# Altium project phone.PrjPcb
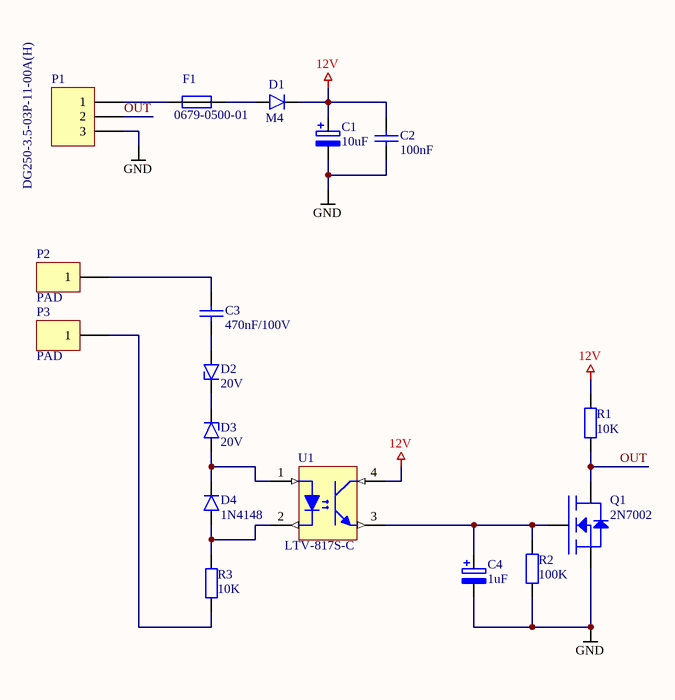
[diagram p0: phone.SchDoc]
1 sheet, 17 parts. Net scope: global (net labels, ports and power ports of the same name join across sheets).
Board file: phone.PcbDoc

## Sheet phone.SchDoc
size A4

### Parts
C1  10uF  [TANC_B]
C2  100nF  [C0805]
C3  470nF/100V  [C1206]
C4  1uF  [TANC_A]
D1  M4  [SMA]
D2  20V  [SOD80C]
D3  20V  [SOD80C]
D4  1N4148  [SOD80C]
F1  0679-0500-01  [0679-0500-01]
P1  DG250-3.5-03P-11-00A(H)  [DG250-3.5-03P-11-00A(H)]
P2  PAD  [PAD]
P3  PAD  [PAD]
Q1  2N7002  [SOT23]
R1  10K  [R0805]
R2  100K  [R0805]
R3  10K  [R0805]
U1  LTV-817S-C  [LTV-817]

### Nets
12V: C1.1 C2.1 D1.1 R1.2 U1.4
GND: C1.2 C2.2 C4.2 P1.3 Q1.2(S) R2.1
OUT: P1.2 Q1.3(D) R1.1
NetC3_1: C3.1 P2.1
NetC3_2: C3.2 D2.2
NetC4_1: C4.1 Q1.1(G) R2.2 U1.3
NetD1_2: D1.2 F1.2
NetD2_1: D2.1 D3.1
NetD3_2: D3.2 D4.1 U1.1
NetD4_2: D4.2 R3.1 U1.2
NetF1_1: F1.1 P1.1
NetP3_1: P3.1 R3.2

### Library data of the parts
C1 C4 = Cap_Pol: Capacitor Polarized
C2 C3 = Cap: Capacitor
D1 D4 = Diode
D2 D3 = Diode Zener
F1 = 0679-0500-01: Bezpiecznik: topikowy; szybki; ceramiczny; 500mA; 125VAC; 125VDC
Q1 = 2N7002(GSD): N-MOSFET
R1-R3 = Res: Resistor
U1 = LTV-817S-C: Transoptor; SMD; Kanały:1; Wyj: tranzystorowe; Uizol:5kV; Uce:35